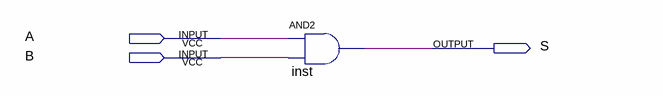
[diagram p0: schematic sheet]
// Quartus schematic ET_Q9.bdf as structural Verilog: 1 symbols, 3 pins
module ET_Q9 (
  input  A,
  input  B,
  output S
);

  and inst (S, A, B);
endmodule
